# EAGLE design Tracksoar v2 active gps (EAGLE 9.0.1)
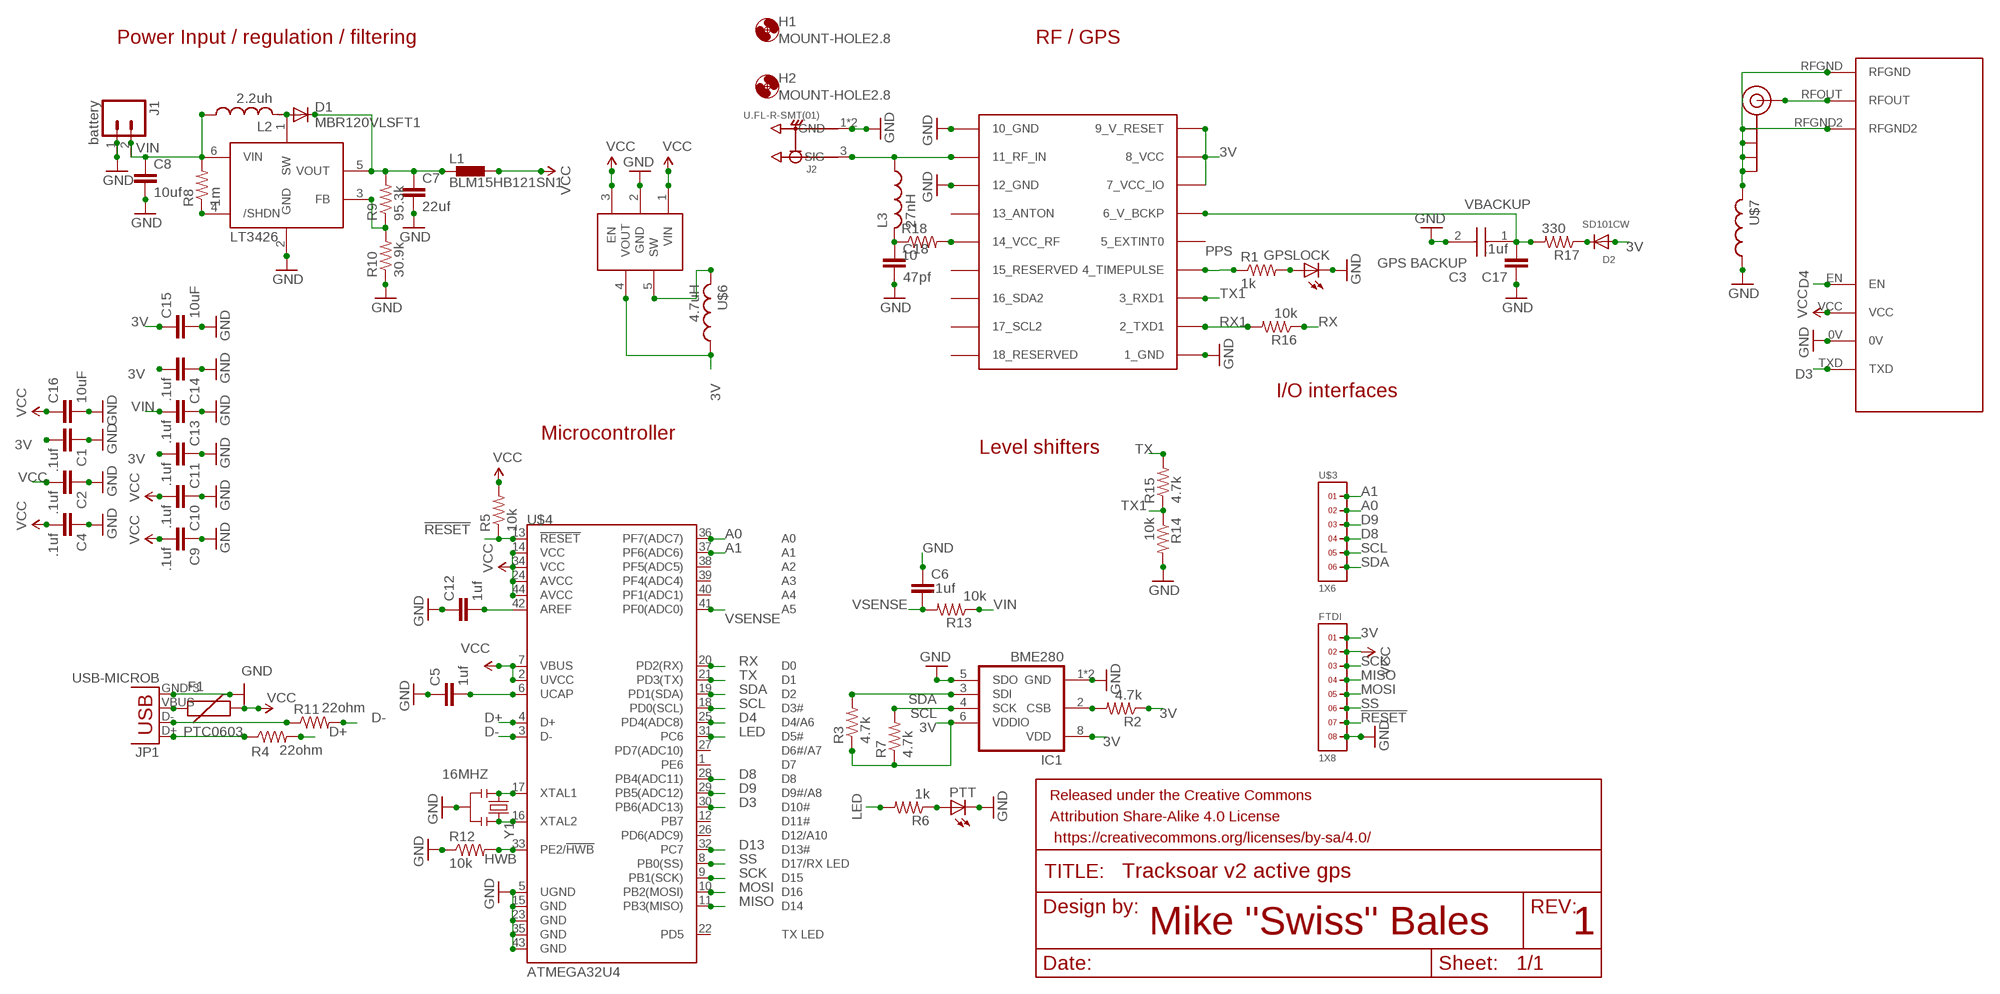
[diagram p0: schematic, sheet 1]

## Parts
C1  .1uf  CAP0402-CAP  [0402-CAP]
C2  .1uf  CAP0402-CAP  [0402-CAP]
C3  GPS BACKUP  DSK-3R3H204T614-H2L  [DSK-3R3H204T614-H2L]
C4  .1uf  CAP0402-CAP  [0402-CAP]
C5  1uf  CAP0402-CAP  [0402-CAP]
C6  .1uf  CAP0402-CAP  [0402-CAP]
C7  22uf  CAP0805  [0805]
C8  10uf  CAP0805  [0805]
C9  .1uf  CAP0402-CAP  [0402-CAP]
C10  .1uf  CAP0402-CAP  [0402-CAP]
C11  .1uf  CAP0402-CAP  [0402-CAP]
C12  1uf  CAP0402-CAP  [0402-CAP]
C13  .1uf  CAP0402-CAP  [0402-CAP]
C14  .1uf  CAP0402-CAP  [0402-CAP]
C15  10uF  10UF-0603-6.3V-20%  [0603]
C16  10uF  10UF-0603-6.3V-20%  [0603]
C17  .1uf  CAP0402-CAP  [0402-CAP]
C18  47pf  CAP0402-CAP  [0402-CAP]
D1  MBR120VLSFT1  DIODE-SOD123  [SOD123]
D2  SD101CW  DIODESOD-123  [SOD-123]
F1  PTC0603  [0603]
FRAME1  FRAME-LETTER  [CREATIVE_COMMONS]
FTDI  1X8  [1X8]
GPSLOCK  LEDCHIP-LED0603  [CHIP-LED0603]
H1  MOUNT-HOLE2.8  [2,8]
H2  MOUNT-HOLE2.8  [2,8]
IC1  BME280  [BME280]
J1  battery  M02JST-PTH-2  [JST-2-PTH]
J2  U.FL-R-SMT(01)  [HRS_U.FL-R-SMT(01)]
J$1  SMA_EDGE  [SMA-EDGE]
JP1  USB-MICROB  [USB-MICROB]
L1  BLM15HB121SN1  [0402]
L2  2.2uh  L-USL1812  [L1812]
L3  27nH  L-USL0402  [L0402]
LT3426  LT3426  [SOT23-6]
PTT  LEDCHIP-LED0603  [CHIP-LED0603]
R1  1k  R-US_R0402  [R0402]
R2  4.7k  R-US_R0402  [R0402]
R3  4.7k  R-US_R0402  [R0402]
R4  22ohm  R-US_R0402  [R0402]
R5  10k  R-US_R0402  [R0402]
R6  1k  R-US_R0402  [R0402]
R7  4.7k  R-US_R0402  [R0402]
R8  1m  R-US_R0402  [R0402]
R9  95.3k  R-US_R0402  [R0402]
R10  30.9k  R-US_R0402  [R0402]
R11  22ohm  R-US_R0402  [R0402]
R12  10k  R-US_R0402  [R0402]
R13  10k  R-US_R0402  [R0402]
R14  10k  R-US_R0402  [R0402]
R15  4.7k  R-US_R0402  [R0402]
R16  10k  R-US_R0402  [R0402]
R17  330  R-US_R0402  [R0402]
R18  10  R-US_R0402  [R0402]
U$1  UBLOX_MAX  [UBLOX_MAX]
U$2  RADIOMETRIX-HX1  [RADIOMETRIX-HX1]
U$3  1X6  [1X6]
U$4  ATMEGA32U4  ATMEGA32U4QFN2  [QFN-44-NOPAD]
U$5  PAM2305  PAM2305-33SOT23-5  [DBV_R-PDSO-G5]
U$6  4.7uH  INDUCTOR_0805_N  [RESC0805_N]
U$7  INDUCTOR_0402_N  [RESC0402_N]
Y1  16MHZ  RESONATOR16MHZ  [RESONATOR-SMD]

## Nets
3V: C1.2 C11.2 C14.2 C15.1 D2.A FTDI.1 IC1.6(VDDIO) IC1.8(VDD) R2.1 R3.1 R7.1 U$1.7_VCC_IO U$1.8_VCC U$1.9_V_RESET U$5.4(VOUT) U$6.1
!RESET: FTDI.7 R5.1 U$4.13(!RESET)
A0: U$3.2 U$4.36(PF7(ADC7))
A1: U$3.1 U$4.37(PF6(ADC6))
D3: U$2.TXD U$4.30(PB6(ADC13))
D4: U$2.EN U$4.25(PD4(ADC8))
D8: U$3.4 U$4.28(PB4(ADC11))
D9: U$3.3 U$4.29(PB5(ADC12))
D13: U$4.32(PC7)
D+: R4.2 U$4.4(D+)
D-: R11.2 U$4.3(D-)
GND: C1.1 C2.1 C3.2(-) C4.1 C5.1 C6.1 C7.2 C8.2 C9.1 C10.1 C11.1 C12.1 C13.1 C14.1 C15.2 C16.2 C17.1 C18.2 FTDI.8 GPSLOCK.C IC1.1(GND) IC1.5(SDO) IC1.7(GND) J1.1 J2.1(GND) J2.2(GND) JP1.GND JP1.MT1(GND) JP1.MT2(GND) LT3426.2(GND) PTT.C R10.1 R12.1 R14.2 U$1.1_GND U$1.10_GND U$1.12_GND U$2.0V U$4.5(UGND) U$4.15(GND) U$4.23(GND) U$4.35(GND) U$4.43(GND) U$5.2(GND) U$7.1 Y1.2
HWB: R12.2 U$4.33(PE2/!HWB)
LED: R6.2 U$4.31(PC6)
MISO: FTDI.4 U$4.11(PB3(MISO))
MOSI: FTDI.5 U$4.10(PB2(MOSI))
N$1: J$1.SIG(SIGNAL) U$2.RFOUT
N$2: IC1.2(CSB) R2.2
N$3: GPSLOCK.A R1.2
N$6: J2.3(SIG) L3.1 U$1.11_RF_IN
N$7: JP1.D- R11.1
N$8: JP1.D+ R4.1
N$9: D1.A L2.2 LT3426.1(SW)
N$12: LT3426.4(/SHDN) R8.1
N$13: LT3426.3(FB) R9.1 R10.2
N$14: F1.1 JP1.VBUS
N$17: C12.2 U$4.42(AREF)
N$18: R18.2 U$1.14_VCC_RF
N$19: C7.1 D1.C L1.1 LT3426.5(VOUT) R9.2
N$20: C5.2 U$4.6(UCAP)
N$21: U$5.5(SW) U$6.2
N$22: D2.C R17.1
N$23: C18.1 L3.2 R18.1
N$27: PTT.A R6.1
PPS: R1.1 U$1.4_TIMEPULSE
RFGND: J$1.GND@0(GND) J$1.GND@1(GND) J$1.GND@2(GND) J$1.GND@3(GND) U$2.RFGND U$2.RFGND2 U$7.2
RX: R16.1 U$4.20(PD2(RX))
RX1: R16.2 U$1.2_TXD1
SCK: FTDI.3 U$4.9(PB1(SCK))
SCL: IC1.4(SCK) R7.2 U$3.5 U$4.18(PD0(SCL))
SDA: IC1.3(SDI) R3.2 U$3.6 U$4.19(PD1(SDA))
SS: FTDI.6 U$4.8(PB0(SS))
TX: R15.2 U$4.21(PD3(TX))
TX1: R14.1 R15.1 U$1.3_RXD1
VBACKUP: C3.1(+) C17.2 R17.2 U$1.6_V_BCKP
VCC: C2.2 C4.2 C9.2 C10.2 C16.1 F1.2 FTDI.2 L1.2 R5.2 U$2.VCC U$4.2(UVCC) U$4.7(VBUS) U$4.14(VCC) U$4.24(AVCC) U$4.34(VCC) U$4.44(AVCC) U$5.1(VIN) U$5.3(EN)
VIN: C8.1 C13.2 J1.2 L2.1 LT3426.6(VIN) R8.2 R13.1
VSENSE: C6.2 R13.2 U$4.41(PF0(ADC0))
XTAL1: U$4.17(XTAL1) Y1.1
XTAL2: U$4.16(XTAL2) Y1.3
Unconnected: U$1.5_EXTINT0 U$1.13_ANTON U$1.15_RESERVED U$1.16_SDA2 U$1.17_SCL2 U$1.18_RESERVED U$4.1(PE6) U$4.12(PB7) U$4.22(PD5) U$4.26(PD6(ADC9)) U$4.27(PD7(ADC10)) U$4.38(PF5(ADC5)) U$4.39(PF4(ADC4)) U$4.40(PF1(ADC1))

## Notes on the sheet
- Power Input / regulation / filtering | RF / GPS
- I/O interfaces
- Microcontroller
- Level shifters
- Mike "Swiss" Bales | 1

## Library data of the parts
C1 C2 C4 C5 C7-C14 C17 C18 = SparkFun-Capacitors:CAP: Capacitor Standard 0603 ceramic capacitor, and 0.1" leaded capacitor.
C3 = DSK-3R3H204T614-H2L:DSK-3R3H204T614-H2L: Coin cell capacitor Source: Datasheet <http://www.elna.co.jp/en/capacitor/double_layer/catalog/pdf/ds_e.pdf>; ARROW_PART_NUMBER: DSK-3R3H204T614-H2L; DESCRIPTION: Coin cell capacitor; HEIGHT: mm; MANUFACTURER_NAME: Elna; MANUFACTURER_PART_NUMBER: DSK-3R3H204T614-H2L
C6 = SparkFun-Passives:CAP: Capacitor Standard 0603 ceramic capacitor, and 0.1" leaded capacitor.
C15 C16 = SparkFun-Capacitors:10UF: 10.0µF ceramic capacitors A capacitor is a passive two-terminal electrical component used to store electrical energy temporarily in an electric field.; PROD_ID: CAP-11015
D1 = diode:DIODE-: DIODE
D2 = adafruit:DIODE: Diode SMADIODE - SMA Surface Mount Package 20V 1A Schottky Diode Digikey: 641-1014-6-ND DO-1N4148 - Through Hole Small Current Diode SOD-123 20V 1 A (.5mV Vf) Schottky Diode - Digikey: MBRX120TPMSCT-ND SOD-323 10V 570mA (.38mV Vf, 3ns) Schottky Diode - Digikey: ZLLS410CT-ND SOD-523 30V 30mA Schottky Diode (RB751S-40TE61) - Digikey: RB751S-40TE61CT-ND SOT23-R/W - SOT23 Package (R = Solder Paste/Reflow Ovens, W = Hand-Soldering) BAT54Film 40V 300mA - Digikey: 497-7162-1-ND
F1 = SparkFun-PowerIC:PTC: Resettable Fuse PTC Resettable Fuse. Spark Fun Electronics SKU : COM-08357
FRAME1 = SparkFun-Aesthetics:FRAME-LETTER: Schematic Frame Standard 8.5x11 US Letter frame
FTDI = headers(2mm):1X8
GPSLOCK PTT = adafruit:LED: LED OSRAM: - CHIPLED LG R971, LG N971, LY N971, LG Q971, LY Q971, LO R971, LY R971 LH N974, LH R974 LS Q976, LO Q976, LY Q976 LO Q996 - Hyper CHIPLED LW Q18S LB Q993, LB Q99A, LB R99A - SideLED LS A670, LO A670, LY A670, LG A670, LP A670 LB A673, LV A673, LT A673, LW A673 LH A674 LY A675 LS A676, LA A676, LO A676, LY A676, LW A676 LS A679, LY A679, LG A679 - Hyper Micro SIDELED® LS Y876, LA Y876, LO Y876, LY Y876 LT Y87S - SmartLED LW L88C, LW L88S LB L89C, LB L89S, LG L890 LS L89K, LO L89K, LY L89K LS L896, LA L896, LO L896, LY L896 - TOPLED LS T670, LO T670, LY T670, LG T670, LP T670 LSG T670, LSP T670, LSY T670, LOP T670, LYG T670 LG T671, LOG T671, LSG T671 LB T673, LV T673, LT T673, LW T673 LH T674 LS T676, LA T676, LO T676, LY T676, LB T676, LH T676, LSB T676, LW T676 LB T67C, LV T67C, LT T67C, LS T67K, LO T67K, LY T67K, LW E67C LS E67B, LA E67B, LO E67B, LY E67B, LB E67C, LV E67C, LT E67C LW T67C LS T679, LY T679, LG T679 LS T770, LO T770, LY T770, LG T770, LP T770 LB T773, LV T773, LT T773, LW T773 LH T774 LS E675, LA E675, LY E675, LS T675 LS T776, LA T776, LO T776, LY T776, LB T776 LHGB T686 LT T68C, LB T68C - Hyper Mini TOPLED® LB M676 - Mini TOPLED Santana® LG M470 LS M47K, LO M47K, LY M47K Source: http://www.osram.convergy.de/
H1 H2 = holes:MOUNT-HOLE: MOUNTING HOLE with drill center marker
IC1 = bosch-bme280:BME280: DIGITAL HUMIDITY, PRESSURE AND TEMPERATURE SENSOR * Digital interface I²C (up to 3.4 MHz) and SPI (3 and 4 wire, up to 10 MHz)* Supply voltage VDD main supply voltage range: 1.71 V to 3.6 V*VDDIO interface voltage range: 1.2 V to 3.6 V Operating range -40…+85 °C, 0…100 % rel. humidity, 300…1100 hPa The library has been designed by Richard Magdycz <https://www.facebook.com/groups/eaglecadsoftUK>
J1 = SparkFun-Connectors:M02: Standard 2-pin 0.1" header. Use with - straight break away headers ( PRT-00116) - right angle break away headers (PRT-00553) - swiss pins (PRT-00743) - machine pins (PRT-00117) - female headers (PRT-00115) Molex polarized connector foot print use with: PRT-08233 with associated crimp pins and housings. 2.54_SCREWTERM for use with PRT-10571. 3.5mm Screw Terminal footprints for PRT-08084 5mm Screw Terminal footprints for use with PRT-08432; PROD_ID: CONN-09863; SKU: PRT-09914
J2 = U.FL-R-SMT_01_:U.FL-R-SMT(01): U.FL Series 6 Ghz 50 Ohm Ultra-small SMT Coaxial Cable Receptacle; AVAILABILITY: Good; DESCRIPTION: U.FL Series 6 Ghz 50 Ohm Ultra-small SMT Coaxial Cable Receptacle; MF: Hirose; MP: U.FL-R-SMT_01_; PACKAGE: None; PRICE: 0.85 USD
J$1 = SparkFun-Connectors:SMA_EDGE: SMA Antenna Connector End launch SMA connector. The paste layer has been removed so that the connector can be hand soldered onto the board after reflow.
JP1 = SparkFun-Connectors:USB: USB Connectors USB-B-PTH is fully proven SKU : PRT-00139/CONN-08278 USB-miniB is fully proven SKU : PRT-00587 USB-A-PCB is untested. USB-A-H is throughly reviewed, but untested. Spark Fun Electronics SKU : PRT-00437 USB-B-SMT is throughly reviewed, but untested. Needs silkscreen touching up. USB-A-S has not been used/tested USB-MB-H has not been used/tested USB-MICROB has been used. CONN-09505; PROD_ID: CONN-09505
L1 = inductors:BLM15H: EMIFIL (R) Chip Ferrite Bead for GHz Noise Source: http://www.murata.com/ Ferrite Bead BLM15H.pdf
L2 = resistor:L-US: INDUCTOR, American symbol
L3 = rcl:L-US: INDUCTOR, American symbol
LT3426 = adafruit:LT3426: LT3426 1.2MHz, 2A boost converter in SOT-23 http://www.linear.com/pc/productDetail.jsp?navId=H0,C1,C1003,C1042,C1031,C1061,P8430 (Linear website)
R1-R18 = adafruit:R-US_: RESISTOR, American symbol
U$1 = Ava:UBLOX_MAX: UBLOX MAX
U$2 = Ava:RADIOMETRIX-HX1
U$3 = headers(2mm):1X6
U$4 = SparkFun-DigitalIC:ATMEGA32U4: Atmel 44-pin 8-bit Microcontroller with 32KBytes of ISP Flash and USB Controller
U$5 = PAM2305-33:PAM2305-33
U$6 U$7 = Nordic_nRF:INDUCTOR: Generic chip inductor
Y1 = SparkFun-FreqCtrl:RESONATOR: Resonator Small SMD resonator. Used, eg, on the Arduino Pro/ Pro Mini boards. 8MHz- XTAL-08895 16MHz- XTAL-08900; PROD_ID: XTAL-08900

## Board
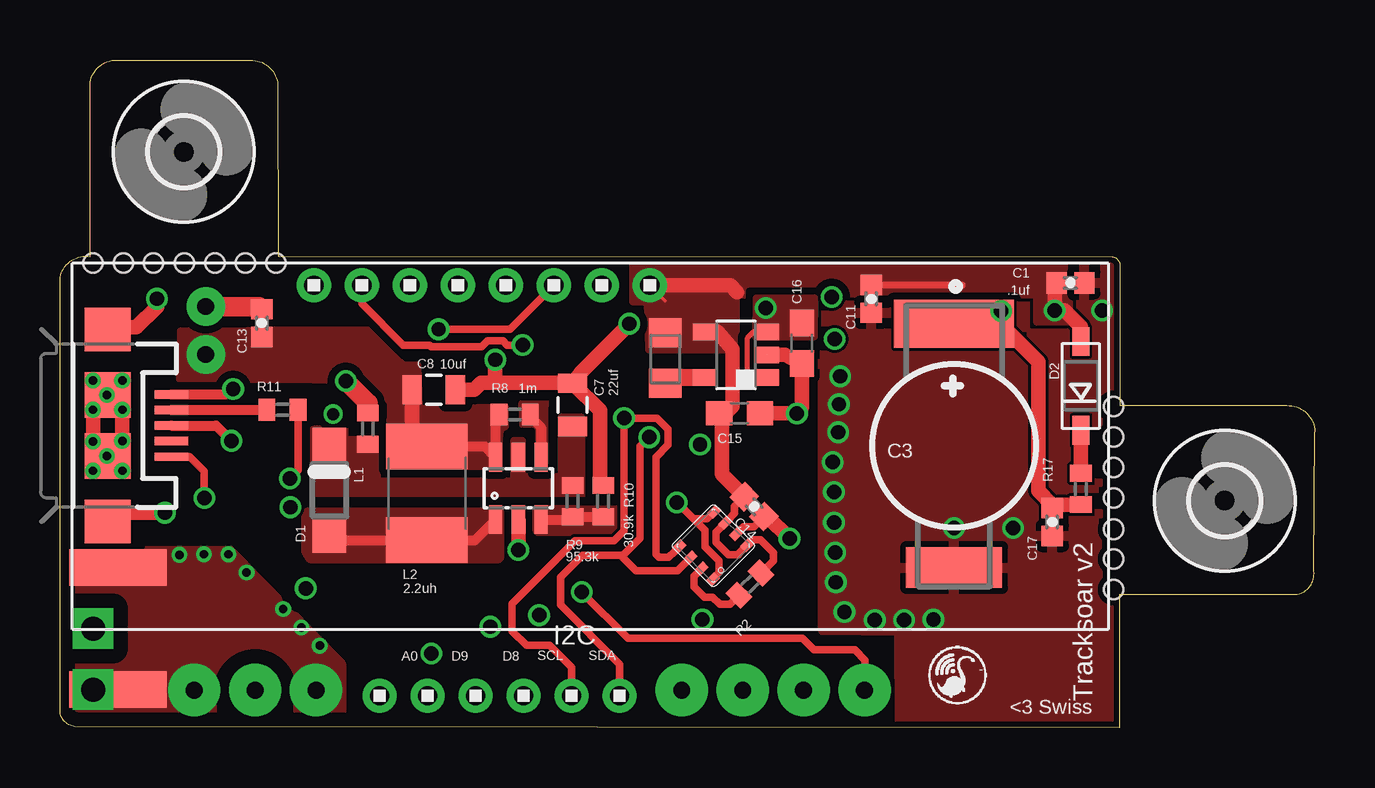
[diagram p1: board, top side]
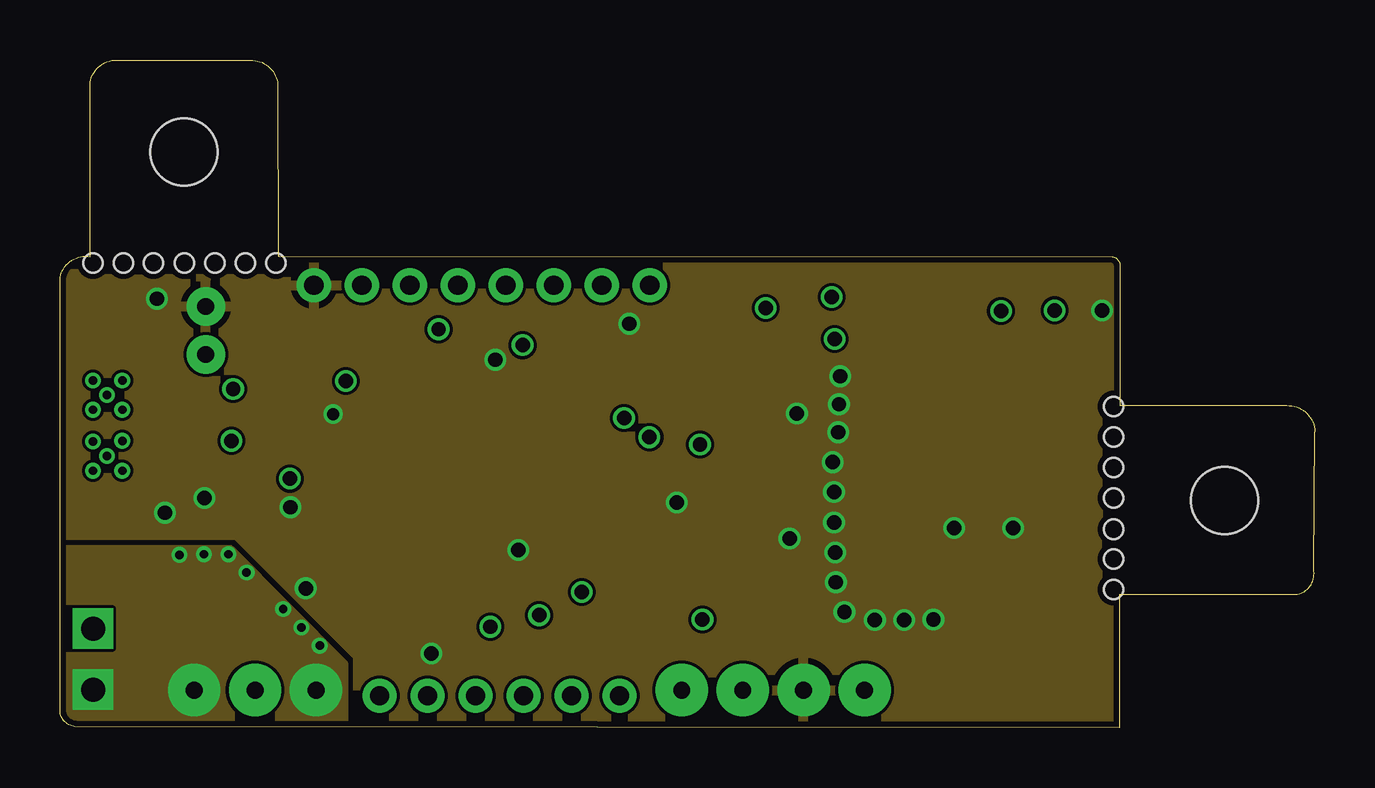
[diagram p2: board, inner layer Route2]
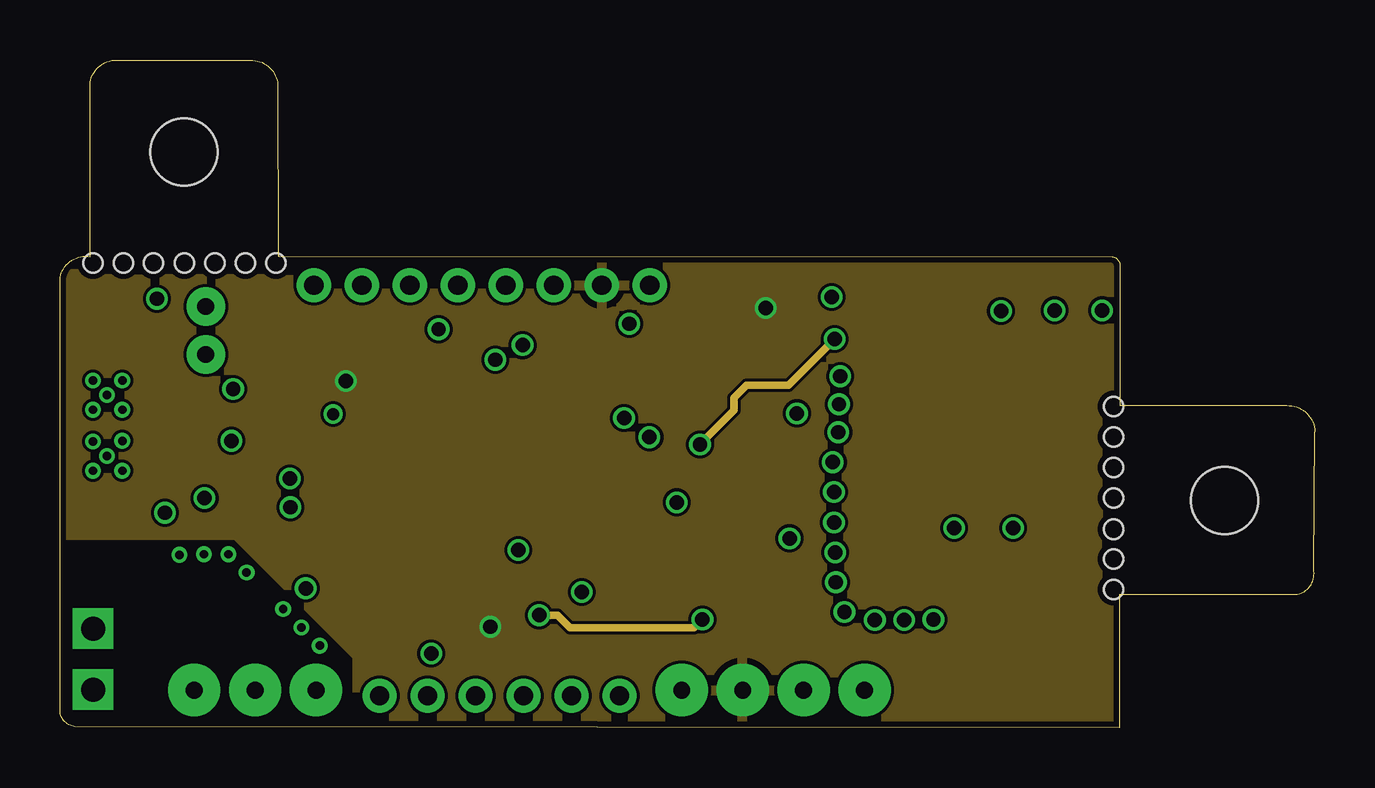
[diagram p3: board, inner layer Route15]
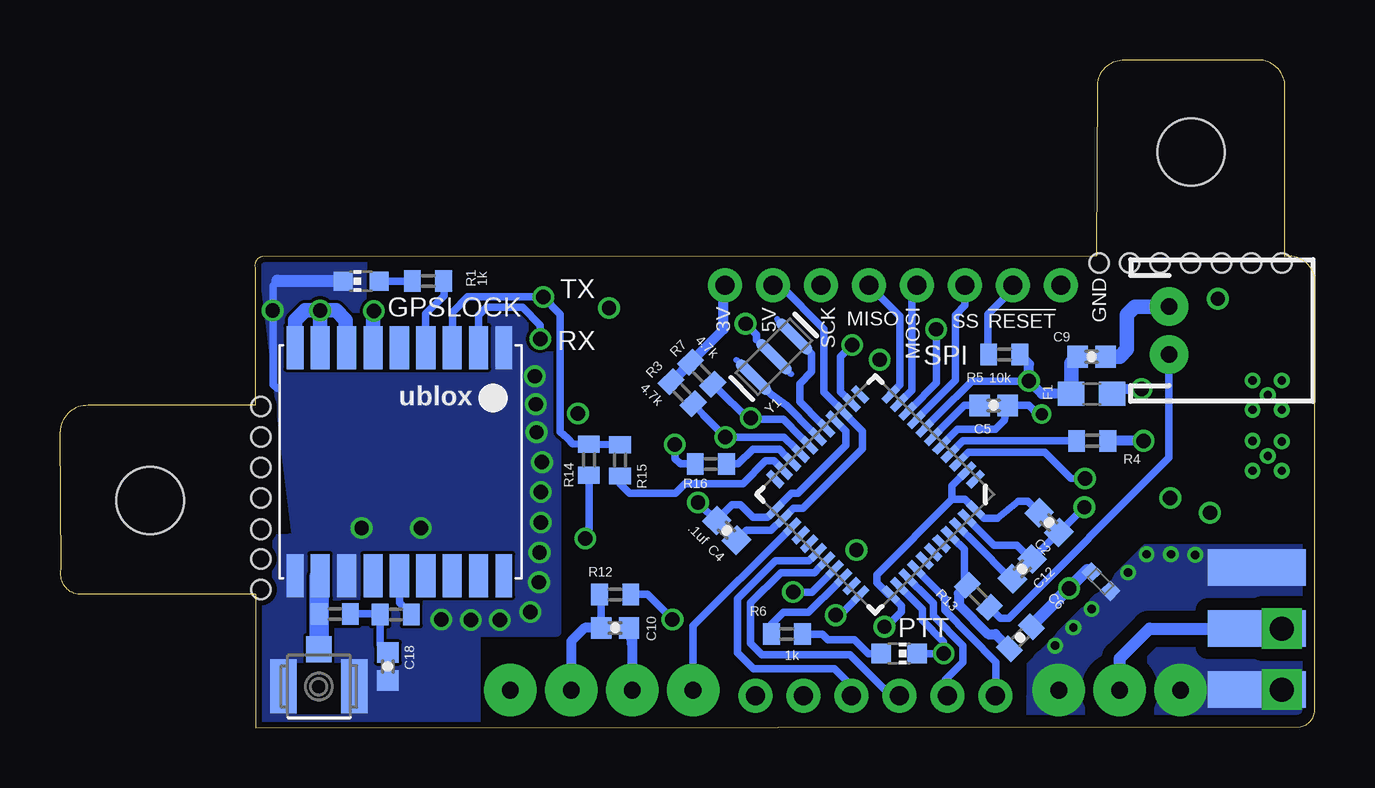
[diagram p4: board, bottom side, seen from below]

Size 52.31 x 27.83 mm. Coordinates in mm from the lower left corner, seen from the top.
Outline: 0.62,0.05 arc-90 0.01,0.86 0.01,18.77 arc-90 1.25,19.63 1.25,26.9 arc-90 2.57,27.81 7.93,27.81 arc-90 9.07,26.8 9.1,19.74 arc90 9.13,19.66 43.87,19.63 arc-90 44.18,19.2 44.18,13.44 51.14,13.44 arc-90 52.31,12.34 52.25,6.6 arc-90 51.57,5.56 44.15,5.56 44.15,0 0.62,0.05
Copper layers (1*2*15*16): Top 0.035mm / dielectric 0.23mm / Route2 0.035mm / dielectric 0.93mm / Route15 0.035mm / dielectric 0.23mm / Bottom 0.035mm
Design rules "MF_Standard_4_Layer": minimum track width 5mil, minimum drill 12mil, track to track 5mil, track to pad 5mil, pad to pad 5mil, via to via 5mil, smd to smd 0mil, copper to edge 10mil, drill to drill 10mil, minimum pad ring 6mil, minimum via ring 6mil, stop-mask expansion 2mil, vias tented up to drill 25mil, thermal gap 10mil
Holes 0.8 mm at 1.38,19.38 2.65,19.38 3.89,19.38 5.19,19.38 6.46,19.38 7.73,19.38 9,19.38 43.92,5.77 43.92,7.04 43.92,8.28 43.92,9.58 43.92,10.85 43.92,12.12 43.92,13.39

### Footprints (pad centres in the part's own frame; a part is rotated, then mirrored left to right if it is on the bottom)
0402-CAP = smd 0.85 x 0.9: 1 -0.58,0; 2 0.58,0
DSK-3R3H204T614-H2L = smd 5 x 2: 1 0,5.075 | smd 4 x 1.7: 2 0,-5.075
0402-CAP' = smd 0.7 x 0.9: 1 -0.65,0; 2 0.65,0
0805 = smd 0.8 x 1.2: 1 -0.9,0; 2 0.9,0
0603 = smd 1.1 x 1: 1 -0.85,0; 2 0.85,0
SOD123 = smd 1.4 x 1.4: A 1.9,0; C -1.9,0
SOD-123 = smd 1.2 x 0.7: A 1.85,0; C -1.85,0
1X8 = drill 0.8 pad 1.422: 1 -7,0; 2 -5,0; 3 -3,0; 4 -1,0; 5 1,0; 6 3,0; 7 5,0; 8 7,0
CHIP-LED0603 = smd 0.8 x 0.8: A 0,-0.75; C 0,0.75
2,8 = hole 2.8: 0,0
BME280 = smd 0.35 x 0.5: 1 0.975,-1.025; 2 0.325,-1.025; 3 -0.325,-1.025; 4 -0.975,-1.025; 5 -0.975,1.025; 6 -0.325,1.025; 7 0.325,1.025; 8 0.975,1.025
JST-2-PTH = drill 0.7 pad 1.6: 1 -1,0; 2 1,0
HRS_U.FL-R-SMT(01) = smd 1.1 x 2.25: 1 -1.475,0; 2 1.475,0 | smd 1.05 x 1.1: 3 0,-1.55
SMA-EDGE = smd 1.524 x 4.064: GND@0 0,0; GND@1 5.08,0; SIG 2.54,0 | smd 1.524 x 4.064 bottom: GND@2 0,0; GND@3 5.08,0
USB-MICROB = smd 0.35 x 1.4: D+ 0,2.65; D- -0.65,2.65; GND 1.3,2.65; ID 0.65,2.65; VBUS -1.3,2.65 | smd 1.8 x 1.9: MT1 -4,0; MT2 4,0 | smd 1.9 x 1.9: P$1 -1.27,0; P$2 1.27,0
0402 = smd 0.7 x 0.9: 1 -0.65,0; 2 0.65,0
L1812 = smd 1.9 x 3.4: 1 -1.95,0; 2 1.95,0
L0402 = smd 0.7 x 0.9: 1 -0.65,0; 2 0.65,0
SOT23-6 = smd 0.55 x 1.2: 1 -0.95,-1.3; 2 0,-1.3; 3 0.95,-1.3; 4 0.95,1.3; 5 0,1.3; 6 -0.95,1.3
R0402 = smd 0.7 x 0.9: 1 -0.65,0; 2 0.65,0
UBLOX_MAX = smd 1.8 x 0.7: 1_GND 4.95,-4.4; 9_V_RESET 4.95,4.3; 10_GND -4.55,4.3; 18_RESERVED -4.55,-4.4 | smd 1.8 x 0.8: 2_TXD1 4.95,-3.35; 3_RXD1 4.95,-2.25; 4_TIMEPULSE 4.95,-1.15; 5_EXTINT0 4.95,-0.05; 6_V_BCKP 4.95,1.05; 7_VCC_IO 4.95,2.15; 8_VCC 4.95,3.25; 11_RF_IN -4.55,3.25; 12_GND -4.55,2.15; 13_ANTON -4.55,1.05; 14_VCC_RF -4.55,-0.05; 15_RESERVED -4.55,-1.15; 16_SDA2 -4.55,-2.25; 17_SCL2 -4.55,-3.35
RADIOMETRIX-HX1 = drill 0.7 pad 2.184: 0V 8.89,-10.16; EN 3.81,-10.16; RFGND -11.43,-10.16; RFGND2 -16.51,-10.16; RFOUT -13.97,-10.16; TXD 11.43,-10.16; VCC 6.35,-10.16
1X6 = drill 0.8 pad 1.422: 1 -5,0; 2 -3,0; 3 -1,0; 4 1,0; 5 3,0; 6 5,0
QFN-44-NOPAD = smd 0.8 x 0.3: 1 -3.4,2.5; 2 -3.4,2; 3 -3.4,1.5; 4 -3.4,1; 5 -3.4,0.5; 6 -3.4,0; 7 -3.4,-0.5; 8 -3.4,-1; 9 -3.4,-1.5; 10 -3.4,-2; 11 -3.4,-2.5; 23 3.4,-2.5; 24 3.4,-2; 25 3.4,-1.5; 26 3.4,-1; 27 3.4,-0.5; 28 3.4,0; 29 3.4,0.5; 30 3.4,1; 31 3.4,1.5; 32 3.4,2; 33 3.4,2.5 | smd 0.3 x 0.8: 12 -2.5,-3.4; 13 -2,-3.4; 14 -1.5,-3.4; 15 -1,-3.4; 16 -0.5,-3.4; 17 0,-3.4; 18 0.5,-3.4; 19 1,-3.4; 20 1.5,-3.4; 21 2,-3.4; 22 2.5,-3.4; 34 2.5,3.4; 35 2,3.4; 36 1.5,3.4; 37 1,3.4; 38 0.5,3.4; 39 0,3.4; 40 -0.5,3.4; 41 -1,3.4; 42 -1.5,3.4; 43 -2,3.4; 44 -2.5,3.4
DBV_R-PDSO-G5 = smd 0.69 x 0.99: 1 -0.95,-1.29; 2 0,-1.29; 3 0.95,-1.29; 4 0.95,1.3; 5 -0.95,1.3
RESC0805_N = smd 1.2 x 1.35: 1 -1.1,0; 2 1,0
RESC0402_N = smd 0.6 x 0.6: 1 -0.55,0; 2 0.55,0
RESONATOR-SMD = smd 0.45 x 1.905: 1 -1.2,0; 2 0,0; 3 1.2,0

### Placement (x,y rotation side)
C1  42.12,18.54 180 top
C2  11.08,8.56 135 bottom
C3  37.27,11.76 0 top
C4  24.52,8.23 315 bottom
C5  13.39,13.44 180 bottom
C6  .1uf  [0402-CAP']  12.27,3.76 225 bottom
C7  21.37,13.46 90 top
C8  15.58,14.1 0 top
C9  9.3,15.47 180 bottom
C10  29.17,4.17 0 bottom
C11  33.81,17.88 90 top
C12  12.2,6.63 225 bottom
C13  8.41,16.87 270 top
C14  28.94,9.22 135 top
C15  28.33,13.11 0 top
C16  30.92,16.03 270 top
C17  41.36,8.59 90 top
C18  38.64,2.57 270 bottom
D1  11.23,9.91 270 top
D2  42.55,14.25 90 top
F1  9.3,13.92 180 bottom
FRAME1  9.91,-12.93 0 top  (outside the outline)
FTDI  17.58,18.44 180 top
GPSLOCK  39.76,18.62 90 bottom
H1  5.16,24 0 top
H2  48.55,9.47 0 top
IC1  27.24,7.59 315 top
J1  6.08,16.56 270 bottom
J2  41.51,1.73 180 bottom
J$1  2.42,1.6 90 bottom
JP1  1.99,12.6 270 top
L1  12.83,12.47 90 top
L2  15.3,9.78 270 top
L3  40.85,4.75 0 bottom
LT3426  19.11,9.98 0 top
PTT  17.33,3.1 270 bottom
R1  36.96,18.62 180 bottom
R2  28.76,5.99 225 top
R3  26.37,13.97 315 bottom
R4  9.28,11.96 180 bottom
R5  12.95,15.56 0 bottom
R6  22,3.91 180 bottom
R7  25.56,14.78 315 bottom
R8  18.95,13.06 180 top
R9  21.37,9.45 90 top
R10  22.64,9.45 270 top
R11  9.28,13.26 0 top
R12  29.17,5.56 0 bottom
R13  14.03,5.49 135 bottom
R14  30.26,11.18 270 bottom
R15  28.96,11.15 270 bottom
R16  25.18,11 180 bottom
R17  42.55,9.96 270 top
R18  38.31,4.72 0 bottom
U$1  38.21,10.9 90 bottom
U$2  22.1,11.73 0 top
U$3  18.32,1.35 0 top
U$4  18.32,9.73 225 bottom
U$5  28.18,15.54 90 top
U$6  25.23,15.37 270 top
U$7  8.92,6.1 315 bottom
Y1  22.55,15.47 45 bottom

### Tracks (layer width: path | path; a pad name or v marks a point on that pad's centre or on a via)
3V  (via drill 0.6)
  Top 0.152: 25.26,16.49 U$6.1 | 25.23,17.79 FTDI.1
  Top 0.305: 41.47,17.41 v41.46,17.4 | IC1.6 27.34,8.16 27.34,7.75 27.87,7.21 28.28,7.21 28.28,7.26 IC1.8 | 29.35,6.58 29.75,6.96 29.75,7.29 29.19,7.85 28.87,7.85 28.76,7.74 IC1.8 | 29.35,6.58 R2.1 29.35,6.58 | 37.59,18.45 C11.2 | 41.52,18.56 C1.2 | 28.3,9.86 C14.2 28.12,9.23 28.12,8.94 27.84,8.66 IC1.6 | IC1.8 | IC1.6
  Top 0.61: C1.2 41.46,18.54 41.46,17.41 41.47,17.41 41.86,17.41 42.55,16.71 D2.A | C14.2 28.3,9.86 27.59,10.58 27.59,12.95 | 28.23,18.16 27.95,18.44 FTDI.1 | 27.59,12.95 28.02,13.41 28.02,15.77 27.41,16.51 27.4,16.49 U$5.4 | C15.1 27.48,13.06 27.59,12.95
  Bottom 0.305: U$1.8_VCC | 24.64,18.18 FTDI.1 | R3.1 26.81,14.43 26.37,14.86 | R7.1 25.57,15.69
  Bottom 0.406: R3.1 26.37,14.86 R7.1 25.57,15.69 24.64,16.61 24.64,18.18
  Bottom 0.61: v41.46,17.4 U$1.8_VCC | U$1.9_V_RESET 42.51,16.98 42.09,17.4 v41.46,17.4 | U$1.7_VCC_IO 40.39,15.88 40.39,16.99 40.8,17.4 v41.46,17.4
  pour Top (isolate 0.305, rank 3, no thermals): 23.88,19.38 42.07,19.38 42.07,16.92 40.72,16.92 40.72,18.06 28.18,18.06 28.18,15.75 24.54,15.75 24.49,17.75 23.88,17.75
!RESET  (via drill 0.6)
  Top 0.305: FTDI.7 12.58,17.67 14.31,15.95 15.41,15.95 15.48,15.88 17.57,15.88 17.81,16.12 18.47,16.12 18.64,15.95 v19.29,15.95
  Bottom 0.254: U$4.13 19.47,13.71
  Bottom 0.305: U$4.13 19.47,13.71 19.77,14 19.77,15.47 v19.29,15.95 | FTDI.7 12.58,18.28 13.62,17.25 13.62,15.58 R5.1
A0
  Bottom 0.152: 16.8,6.09 U$4.36 16.79,6.08
  Bottom 0.305: U$4.36 16.09,5.38 | 16.09,5.38 15.91,5.19 15.91,4.67 14.66,3.43 14.66,2.74 15.4,2.01 U$3.2 | U$4.36 16.68,5.96 | U$4.36 16.09,5.38
A1
  Bottom 0.152: U$4.37
  Bottom 0.305: U$3.1 13.29,2.75 15.42,4.9 15.42,5.41 16.5,6.49 U$4.37
D3  (via drill 0.6)
  Top 0.305: v21.75,5.66 23.68,3.73 30.94,3.73 31.43,3.25 33.13,3.25 33.56,2.82 33.56,1.6 U$2.TXD
  Bottom 0.254: U$4.30 20.24,6.4 20.24,6.39
  Bottom 0.305: U$4.30 20.24,6.39 20.96,5.66 v21.75,5.66
D4
  Bottom 0.254: U$4.25 22.01,8.16 | 22.01,8.16
  Bottom 0.305: U$4.25 22.01,8.16 25.91,4.25 U$2.EN
D8
  Bottom 0.254: U$4.28 20.96,7.09
  Bottom 0.305: U$4.28 20.96,7.09 21.09,6.96 22.49,6.96 24.06,5.38 24.06,3.12 23.4,2.46 20.02,2.46 19.4,1.84 U$3.4
D9
  Bottom 0.254: U$4.29 20.63,6.71
  Bottom 0.305: U$4.29 20.63,6.71 20.86,6.48 22.26,6.48 23.53,5.21 23.53,3.53 23.04,3.05 19.38,3.05 17.65,1.32 U$3.3
D+
  Bottom 0.254: U$4.4 15.05,11.59
  Bottom 0.305: R4.2 14.67,11.96 15.05,11.59 U$4.4
D-  (via drill 0.6)
  Top 0.305: 9.86,13.19 R11.2 9.93,10.73 v9.58,10.39
  Bottom 0.305: v9.58,10.39 10.17,10.41 11.26,11.48 14.45,11.48 14.63,11.3 U$4.3 | U$4.3
GND  (via drill 0.5, 0.6)
  Top 0.305: C14.1 29.35,8.79 28.94,8.38 28.48,8.38 28.29,8.19 IC1.7 | 27.33,6.32 IC1.1 27.33,6.32 | 27.33,6.32 27.47,6.46 27.47,6.96 26.88,7.56 26.88,8.23 26.4,8.71 | 26.4,8.71 v25.71,9.4 | 27.16,8.89 IC1.5 27.16,8.89 | 27.16,8.89 26.97,8.71 26.4,8.71 | C14.1 29.6,8.56 | 32.52,14.85 v32.52,14.66 | JP1.GND 5.4,11.3 6,10.69 6,9.6 v6.03,9.58 | 18.14,14.45 18.22,14.38 | C14.1 29.5,8.81 | IC1.7 | 27.16,8.89
  Top 0.508: JP1.MT2 2.36,8.97
  Top 0.61: C7.2 21.7,14.81 v23.73,16.84 | R10.1 22.51,10.1 22.51,13.24 C7.2 | C8.2 17.25,14.1 17.56,14.38 18.22,14.38 21.23,14.38 C7.2 | U$5.2 30.22,15.54 C16.2 30.92,13.36 30.66,13.11 | C14.1 29.5,8.81 v30.41,7.9 | 2.36,8.97 v4.38,8.97 | JP1.MT1 2.08,16.69 3.18,16.69 4.05,17.55 v4.05,17.88 | C15.2 30.66,13.11 | 30.66,13.11 v30.72,13.11 | v18.14,15.34 18.14,14.45 | LT3426.2 v19.11,7.42
  Top 0.813: 6.06,17.58 J1.1 6.68,17.56 6.69,17.55 8.31,17.55 C13.1
  Bottom 0.152: Y1.2 23.26,16.18
  Bottom 0.254: U$4.23 22.51,9.09 22.61,8.99 | C6.1 11.82,4.24 11.55,4.51 | C2.1 10.65,8.15 10.37,8.43 | U$4.15 | C12.1
  Bottom 0.305: U$4.15 19.78,12.61 19.54,12.36 19.54,11.79 21.55,9.78 21.83,9.78 22.49,9.11 | 22.49,9.11 U$4.23 | 15.15,12.19 U$4.5 15.15,12.19 | 15.15,12.19 14.9,12.45 13.32,12.45 12.95,12.82 C5.1 11.92,13.44 11.56,13.08 v11.39,13.08 | 16.78,5.35 U$4.35 16.78,5.35 | U$4.43 13.38,7.62 12.43,7.62 11.85,7.04 C12.1 | v23.73,16.84 23.26,16.37 23.26,16.18 | 11.87,7.06 C12.1 | 22.49,9.11 22.61,8.99 22.82,8.79 23.43,8.79 23.93,9.3 24.29,9.3 24.93,8.66 | 24.93,8.66 C4.1 | R12.1 29.75,5.81 C10.1 | C4.1 25.41,9.09 v25.71,9.4 | R14.2 30.26,8.05 v30.41,7.9 | PTT.C v15.48,3.1 15.48,3.59 16.36,4.48 16.36,4.94 16.78,5.35 | 43.21,18.62 43.42,18.41 43.42,14.3 43.26,14.15 | v9.61,9.19 10.37,8.43 C2.1 11,7.83 C12.1 | U$7.1 9.37,6.48 9.47,6.59 | U$4.43 14.24,8.48 | U$4.43 | C4.1 24.93,8.66
  Bottom 0.406: C10.1 30.44,4.17 30.99,3.61 U$2.0V | C6.1 11.76,4.29
  Bottom 0.508: 11.76,4.29 11.55,4.51 v10.24,5.82 | 10.24,5.84 v10.24,5.82 | GPSLOCK.C 43.21,18.62 43.24,18.64 | v10.24,5.82 9.47,6.59 U$7.1
  Bottom 0.61: C9.1 8.13,15.47 7.83,15.77 7.83,17.22 7.5,17.55 6.09,17.55 J1.1
  other vias: 32.32,7.32 32.34,6.07 32.7,4.83 33.97,4.5 35.19,4.5 36.4,4.52 32.26,8.56 32.26,9.83 32.21,11.07 32.44,12.32 32.47,13.49 37.27,8.33 39.73,8.33 43.44,17.4
  pour Route2: -0.02,19.61 26.35,19.66 32.32,19.61 43.85,19.61 43.85,4.11 43.9,4.06 43.9,0.15 12.43,0.05 12.43,2.97 7.37,8.03 0.06,8.03
  pour Top (rank 4): 31.81,19.58 43.87,19.63 43.87,4.11 43.95,0.08 39.1,0.08 39.05,0.1 35.01,0.03 34.98,4.04 31.81,4.06
  pour Bottom (no thermals): 31.6,19.58 43.87,19.63 42.45,7.92 42.32,7.98 40.49,7.98 43.9,7.85 43.9,0.05 34.96,0.08 34.96,4.01 31.6,4.01
HWB  (via drill 0.6)
  Route15 0.305: v19.97,4.7 20.73,4.7 21.27,4.17 26.42,4.17 v26.78,4.52
  Bottom 0.254: U$4.33 19.2,5.32 19.2,5.3
  Bottom 0.305: U$4.33 18.96,5.54 19.2,5.3 19.79,4.7 v19.97,4.7 | R12.2 27.82,5.56 v26.78,4.52
LED
  Bottom 0.254: U$4.31 19.89,6.04 | 19.89,6.04
  Bottom 0.305: U$4.31 19.89,6.04 21.1,4.83 22.16,4.83 22.65,4.33 R6.2
MISO
  Bottom 0.254: U$4.11 17.57,14.01 17.57,14.03
  Bottom 0.305: 17.58,14 U$4.11 17.68,13.92 17.57,14.03 17.3,14.3 17.3,17.16 FTDI.4
MOSI
  Bottom 0.254: U$4.10 17.22,13.66 | 17.22,13.66
  Bottom 0.305: U$4.10 17.22,13.66 16.8,14.08 16.8,17.86 16.58,18.07 FTDI.5
N$1
  Bottom 0.305: J$1.SIG 1.35,4.14 1.35,4.19
  Bottom 0.508: U$2.RFOUT 8.13,2.9 6.89,4.14 1.35,4.14
N$2
  Top 0.305: IC1.2 | 28.19,5.42 27.92,5.16 27.5,5.16 27.2,5.46 26.86,5.46 26.42,5.89 26.42,6.32 26.63,6.53 IC1.2 | 28.19,5.42 R2.2 28.19,5.42 | IC1.2
N$3
  Bottom 0.305: GPSLOCK.A R1.2
N$6
  Bottom 0.305: U$1.11_RF_IN 41.5,6.31
  Bottom 0.813: 41.5,6.31 L3.1 41.5,3.29 J2.3
N$7
  Top 0.406: JP1.D- R11.1
N$8  (via drill 0.6)
  Top 0.406: JP1.D+ 6.51,12.6 v7.14,11.96
  Bottom 0.406: v7.14,11.96 R4.1
N$9
  Top 0.406: D1.A 11.92,7.83 L2.2 17.3,7.83 LT3426.1
  pour Top (no thermals): 10.34,8.89 17.81,8.89 18.09,8.94 18.22,8.97 18.22,7.16 10.5,7.16 10.37,7.37 10.37,8.46
N$12
  Top 0.406: R8.1 19.61,12.96 20.05,12.52 LT3426.4
  pour Top (isolate 0.406, rank 3, no thermals): 19.87,12.62 19.31,12.62 19.31,12.73 19.26,13.51 20.3,13.51 20.33,13.46 20.33,10.87 19.89,10.87
N$13
  Top 0.406: LT3426.3 21.37,8.68 R9.1 R10.2
  pour Top (rank 5, no thermals): 20,9.02 23.15,8.97 23.2,8.86 23.22,8.46 23.25,8.31 20.28,8.31 20,8.28
N$14  (via drill 0.6)
  Top 0.406: JP1.VBUS 6.89,13.9 v7.22,14.12
  Bottom 0.406: v7.22,14.12 8.33,14.12 F1.1
N$17
  Bottom 0.254: C12.2 12.69,6.22 12.75,6.28
  Bottom 0.305: U$4.42 14.14,7.66 | 14.14,7.66 12.75,6.28 12.63,6.16 C12.2 | U$4.42 14.63,8.16 | U$4.42 14.14,7.66
N$18
  Bottom 0.305: U$1.14_VCC_RF 38.16,5.22 R18.2
N$19
  Top 0.305: D1.C 11.59,11.96 | 12.7,11.96 L1.1
  Top 0.406: 19.08,11.26 LT3426.5
  pour Top (isolate 0.305, no thermals): 20.91,12.95 21.9,12.95 21.9,9.78 10.55,9.78 10.55,12.42 10.62,12.45 11.87,12.45 11.87,12.01 13.16,12.01 13.21,10.29 18.93,10.29 18.93,11.96 19.26,11.96 19.26,10.46 20.91,10.46
N$20
  Bottom 0.305: 15.27,12.78 U$4.6 15.27,12.78 | 15.27,12.78 14.61,13.44 C5.2
N$21
  Top 0.61: 25.46,14.59 U$6.2
  Top 0.711: U$5.5 25.46,14.59
N$22
  Top 0.61: D2.C R17.1
N$23
  Bottom 0.305: L3.2 38.99,4.75 R18.1 38.96,3.46 C18.1
N$27
  Bottom 0.305: R6.1 20.53,3.91 20.3,3.68 19.18,3.68 18.6,3.1 PTT.A
P$1  (via drill 0.35)
  Top 0.152: v2.6,14.48 2.57,14.48 v1.96,13.87 | v1.96,13.87 1.96,13.89 v1.38,14.48 | v1.38,13.26 1.38,13.28 v1.96,13.87 | v1.96,13.87 1.99,13.87 v2.6,13.26 | v2.6,11.96 v1.96,11.33 | v1.96,11.33 1.96,11.35 v1.38,11.94 | v1.96,11.33 1.96,11.3 v1.38,10.72 | v1.96,11.33 1.99,11.33 v2.6,10.72
  Top 0.61: v2.6,13.26 v2.6,11.96 | v1.38,11.94 v1.38,13.26
PPS
  Bottom 0.305: R1.1 36.3,18.01 37.06,17.25 U$1.4_TIMEPULSE
RFGND  (via drill 0.35, 1 pad 1.68)
  Top 0.61: 1.99,7.11 J$1.GND@1
  other vias: 10.83,3.43 10.06,4.19 9.3,4.95 7.78,6.48 7.02,7.24 6,7.24 4.98,7.21 1.38,1.6
  pour Bottom (isolate 0.508, no thermals): -0.02,7.44 7.02,7.47 11.82,2.64 11.84,0.08 -0.02,0.08
  pour Top (isolate 0.61, no thermals): 0.03,7.39 7.09,7.39 11.72,2.67 11.72,0.15 0.01,0.08
  pour Route2 (rank 2, no thermals): 11.69,0.05 0.06,0.05 0.06,7.39 7.04,7.39 11.77,2.64 11.77,0.1
RFOUT  (via drill 1 pad 1.68)
  other vias: 1.38,4.14
RX
  Bottom 0.254: U$4.20 22.06,11.35
  Bottom 0.305: U$4.20 22.06,11.35 22.32,11.61 23.43,11.61 24.04,11 R16.1
RX1  (via drill 0.6)
  Route15 0.305: v32.29,16.2 30.36,14.27 28.61,14.27 28.1,13.76 28.1,13.24 v26.68,11.81
  Bottom 0.305: U$1.2_TXD1 34.86,17.19 34.53,17.53 33.03,17.53 32.29,16.79 v32.29,16.2 | v26.68,11.81 26.68,11.23 26.45,11 R16.2
SCK  (via drill 0.6)
  Top 0.305: 15.78,16.64 v15.78,16.61 18.75,16.61 FTDI.3
  Bottom 0.254: U$4.9 16.96,13.19
  Bottom 0.305: U$4.9 16.96,13.19 16.85,13.31 15.78,14.38 v15.78,16.61
SCL  (via drill 0.6)
  Top 0.305: U$3.5 21.32,2.54 20.4,3.45 19.44,3.45 18.85,4.04 18.85,5.18 21.47,7.8 23.1,7.8 23.51,8.22 v23.51,12.92 23.53,12.9 24.89,12.9 25.35,12.44 25.35,11.79 24.85,11.29 24.85,7.24 24.98,7.11 25.37,7.11 25.61,7.34 IC1.4 | IC1.4 | IC1.4
  Bottom 0.254: U$4.18 | U$4.18 21.42,12.12
  Bottom 0.305: U$4.18 21.42,12.12 22.15,12.85 23.45,12.85 v23.51,12.92 23.68,12.93 24.88,14.11 | 24.88,14.11 R7.2 24.89,14.11 24.88,14.11
SDA  (via drill 0.6)
  Top 0.305: 24.57,12.14 v24.57,12.12 24.19,11.73 24.19,7.9 23.48,7.19 | 23.48,7.19 21.77,7.19 20.86,6.27 20.86,5.13 23.32,2.65 U$3.6 | 23.48,7.19 23.48,7.09 24.01,6.55 25.73,6.55 26.17,6.99 IC1.3 | IC1.3 | IC1.3
  Bottom 0.254: U$4.19 | U$4.19 21.66,11.65
  Bottom 0.305: U$4.19 21.66,11.65 22.12,12.12 v24.57,12.12 25.48,13.03 25.7,13.27 | 25.7,13.27 R3.2 25.91,13.49 25.7,13.27
SS
  Bottom 0.305: 14.54,18.39 FTDI.6 14.58,17.6 14.99,17.2 14.99,14.48 16.29,13.18 | 16.29,13.18 16.62,12.85 U$4.8 16.29,13.17 16.29,13.18
TX
  Bottom 0.254: U$4.21 22.27,10.85
  Bottom 0.305: U$4.21 22.27,10.85 22.55,11.12 22.89,11.12 23.83,10.19 26.25,10.19 26.65,9.78 28.56,9.78 28.96,10.19 R15.2
TX1  (via drill 0.6)
  Bottom 0.305: U$1.3_RXD1 35.95,15.86 35.95,17.32 35.31,17.96 v32.16,17.96 31.45,17.25 31.45,12.34 31.16,12.07 30.93,11.85 R14.1 29.09,11.8 R15.1
VBACKUP  (via drill 0.6)
  Top 0.61: R17.2 41.35,9.31 | 41.35,9.31 40.77,9.88 40.77,15.27 39.2,16.83 | 39.2,16.83 C3.1 | v39.22,17.37 39.2,17.35 39.2,16.83 | C17.2 41.36,9.3 41.35,9.31
  Bottom 0.61: U$1.6_V_BCKP 39.26,17.16 39.25,17.17 39.25,17.35 v39.22,17.37
VCC  (via drill 0.6)
  Top 0.203: U$5.1 28.87,14.59 28.66,14.81 28.66,16.26 28.91,16.51 28.93,16.49 U$5.3
  Top 0.61: L1.2 12.83,13.54
  Top 0.813: 12.83,13.54 v11.92,14.45
  Bottom 0.254: U$4.24 22.16,8.74 | U$4.14 20.03,13.56 | C2.2 | C2.2 11.72,9.19
  Bottom 0.305: U$4.44 14.29,9.24 | 14.29,9.24 14.58,9.52 15.12,9.52 | 15.12,9.52 18.26,6.39 18.26,6.06 17.76,5.56 U$4.34 | FTDI.2 22.27,18.45 20.45,16.61 20.45,13.98 20.03,13.56 U$4.14 19.66,13.18 18.85,12.37 18.85,11.63 21.34,9.14 21.73,9.14 U$4.24 22.16,8.74 22.66,8.23 23.7,8.23 24.01,7.92 C4.2 | 14.86,10.36 U$4.2 14.86,10.36 | 14.86,10.36 15.12,10.1 15.12,9.52 | U$4.34 | 15.69,13.07 U$4.7 15.69,13.07 | 15.69,13.07 14.3,14.45 v11.92,14.45 | U$4.34 17.23,5.1 17.23,4.85 17.86,4.22 v17.94,4.22 | U$4.44 13.79,8.74 13.24,8.74 12.35,9.45 11.97,9.45 11.72,9.19 C2.2 | U$4.44 14.29,9.24 | C4.2 | 14.86,10.36
  Bottom 0.406: 28.45,3.95 U$2.VCC | R5.2 11.92,15.17 v11.92,14.45 11.39,13.92 F1.2 | C10.2 28.47,3.52
  Bottom 0.61: 28.45,3.95 28.45,4.1 C10.2 | F1.2 10.15,15.2 C9.2
  other vias: 29.42,17.5
  pour Route15: -0.02,19.61 26.37,19.66 32.34,19.61 43.92,19.61 43.92,4.09 43.87,4.04 43.87,0.13 12.43,0.05 12.4,0.08 12.4,2.97 7.35,8.03 0.06,8.03
  pour Top (rank 2, no thermals): 29.04,17.91 31.45,17.91 31.43,16.31 29.01,16.31
VIN
  Top 0.406: R8.2 18.16,13.01 LT3426.6 17.71,11.73 L2.1 14.68,12.35
  Top 0.61: C8.1 14.68,12.35
  Bottom 0.254: R13.1
  Bottom 0.305: R13.1 13.37,4.83 13.11,4.57 12.76,4.57 6.08,11.25 J1.2
  pour Top (isolate 0.305, rank 2, no thermals): 11.92,14.48 12.81,14.48 13.77,13.56 13.75,10.9 18.29,10.9 18.29,12.14 18.55,12.57 18.55,13.36 14.97,13.31 14.92,15.11 14.28,15.14 13.98,15.42 12.86,16.56 8.95,16.56 6.64,16.54 5.04,16.54 4.98,14.55 8.08,14.5 9.07,14.53
VSENSE
  Bottom 0.254: C6.2 12.73,3.33 12.96,3.56 | R13.2 14.61,6.07
  Bottom 0.305: R13.2 14.61,6.07 14.61,7.44 14.82,7.65 14.83,7.65 14.98,7.81 | 14.98,7.81 U$4.41 14.98,7.81 | 14.98,7.81
  Bottom 0.406: R13.2 14.84,5.59 14.84,5.13 13.62,3.91 13.31,3.91 12.96,3.56 12.81,3.4 C6.2
XTAL1
  Bottom 0.152: Y1.1
  Bottom 0.254: U$4.17 | U$4.17 20.94,12.34
  Bottom 0.305: U$4.17 20.94,12.34 22.01,13.42 22.68,13.9 Y1.1
XTAL2
  Bottom 0.152: Y1.3 | Y1.3 20.98,15.6
  Bottom 0.254: U$4.16 | U$4.16 20.61,12.72
  Bottom 0.305: U$4.16 20.61,12.72 21.47,13.58 21.47,14.35 20.98,14.84 20.98,15.6 Y1.3

### Text on the board
tNames: Tracksoar v2 | A0 | D9 | D8 | SCL | I2C | SDA | <3 Swiss
bNames: GND | TX | MISO | 5V | 3V | !RESET | SS | SCK | RX | SPI | MOSI